# EAGLE design ElectronBoardMKII (EAGLE 9.2.0)
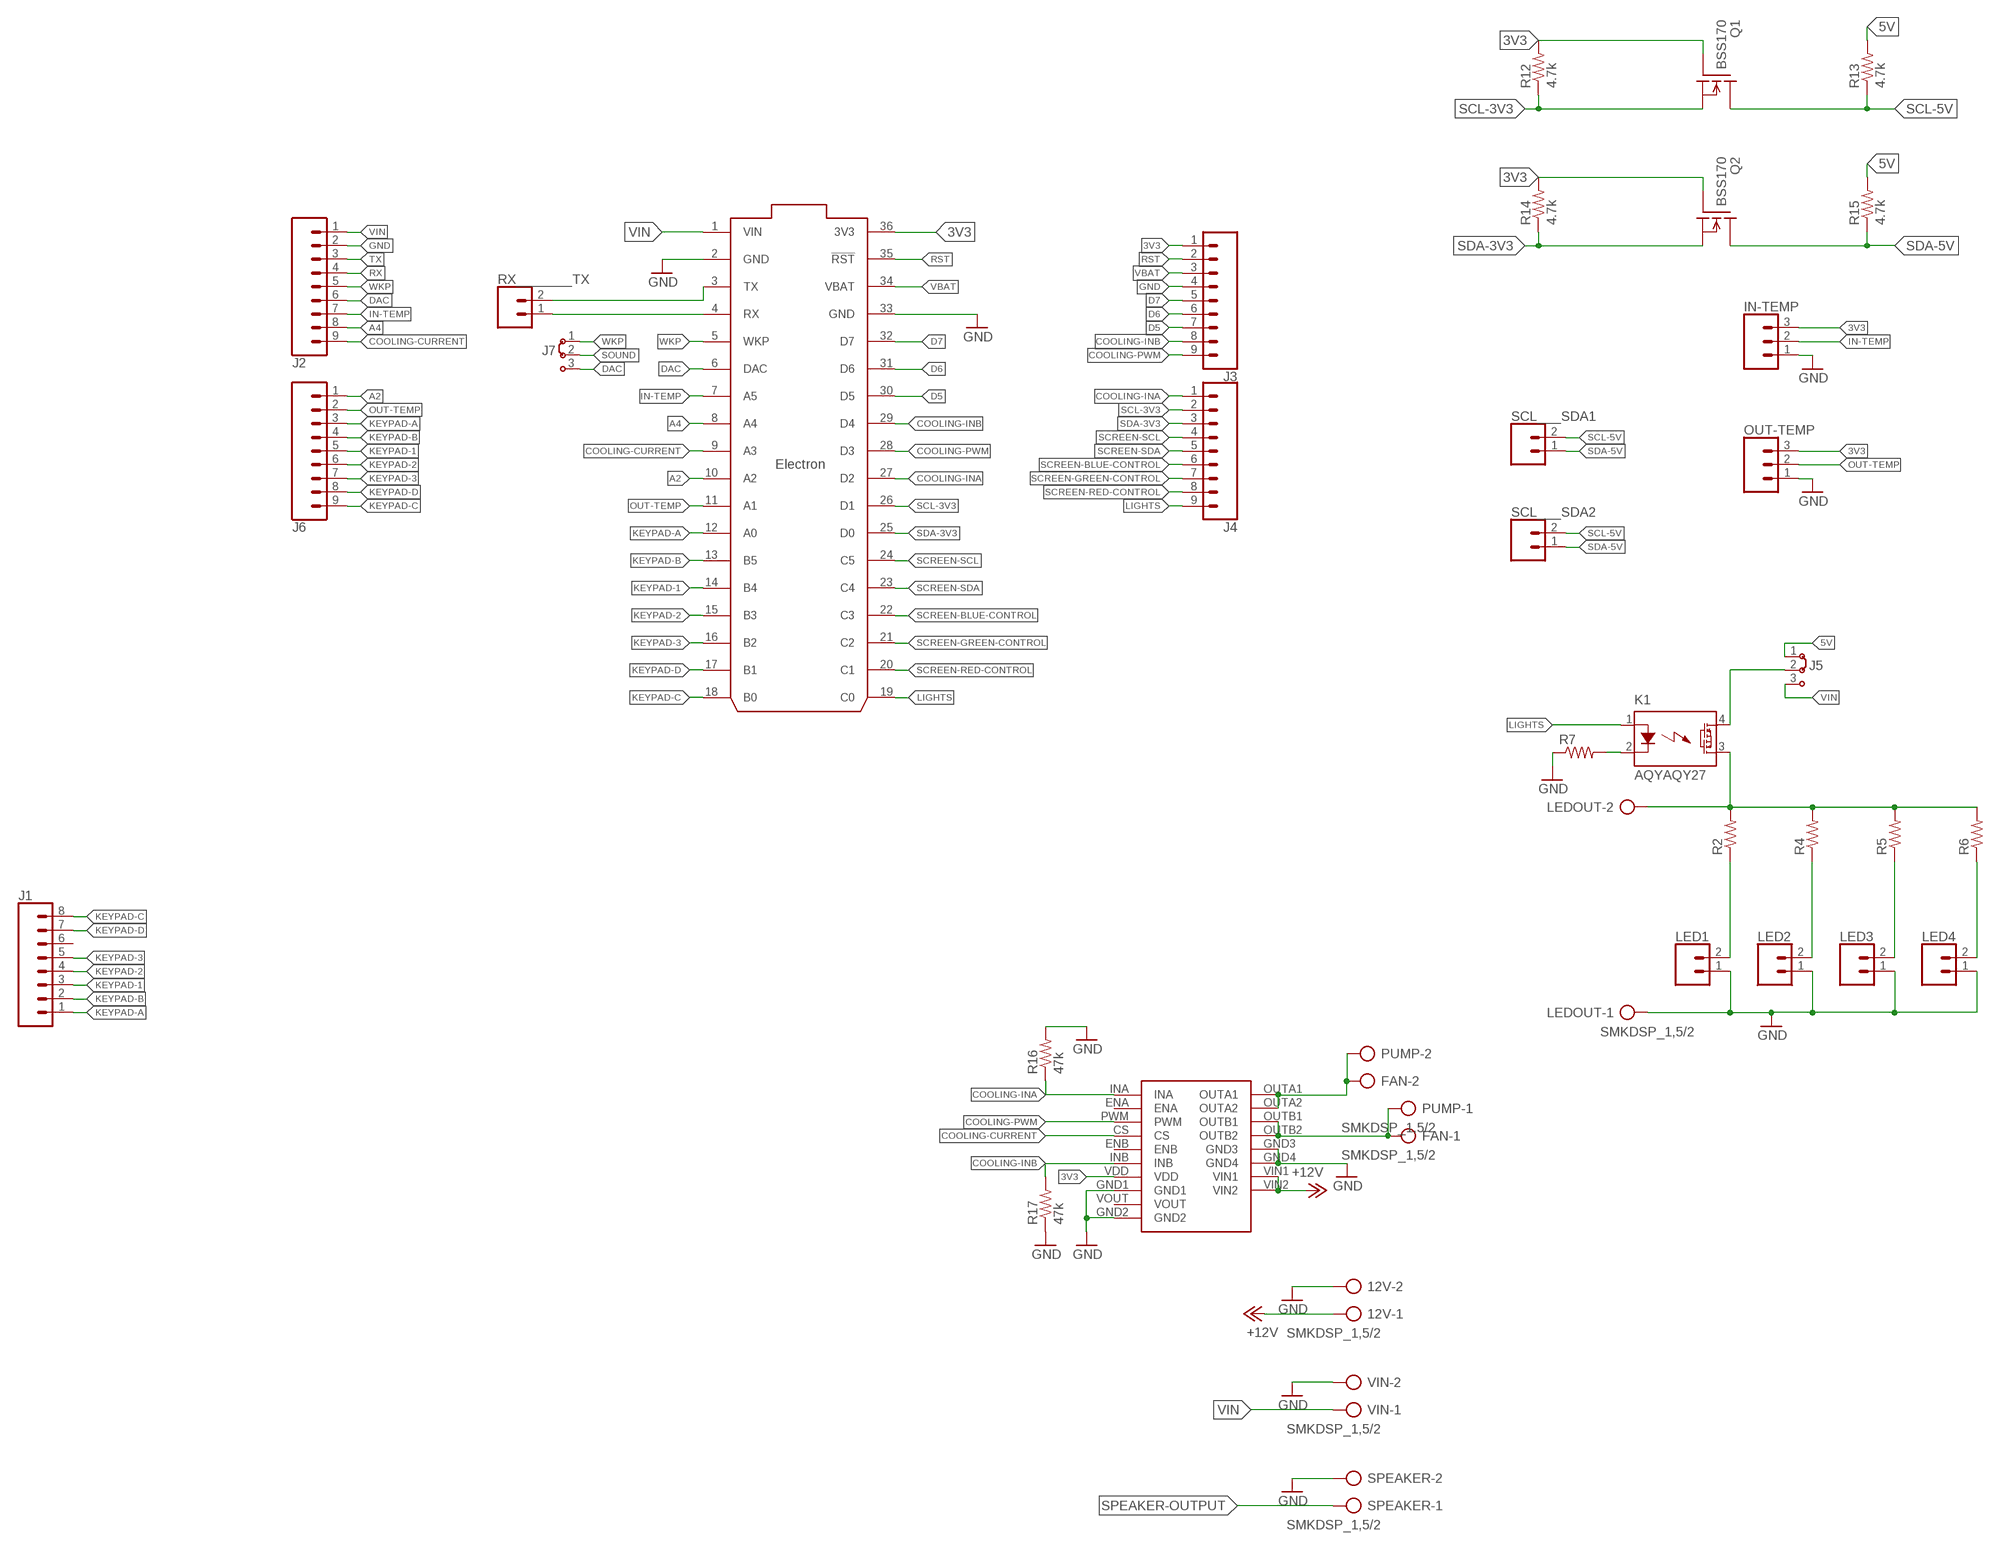
[diagram p0: schematic, sheet 1, part 1 of 2]
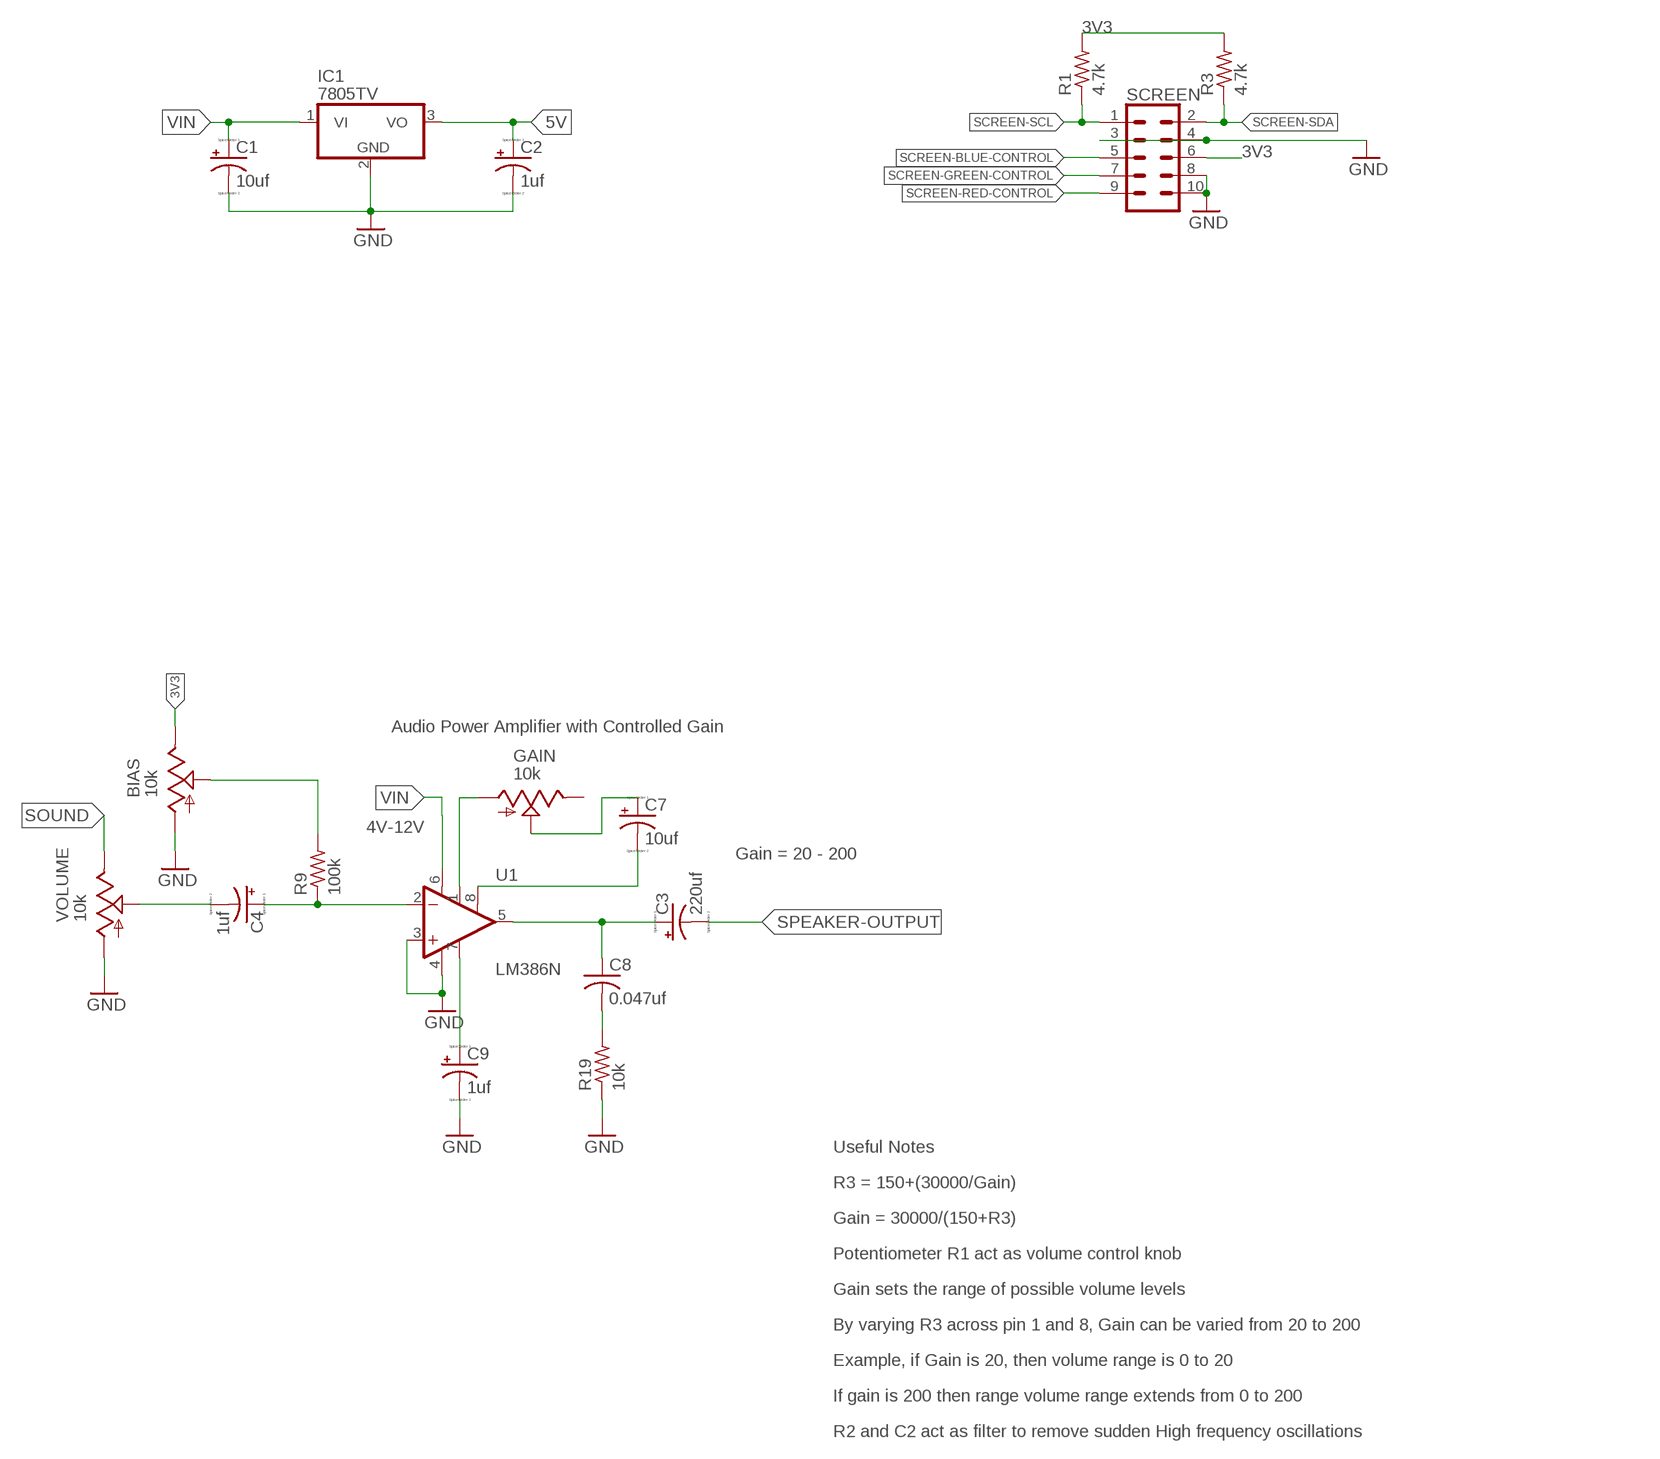
[diagram p1: schematic, sheet 1, part 2 of 2]

## Parts
12V  SMKDSP_1,5/2  [SMKDSP_1,5/2]
BIAS  10k  TRIM_US-CT6  [CT6]
C1  10uf  CPOL-USE5-8.5  [E5-8,5]
C2  1uf  CPOL-USE5-8.5  [E5-8,5]
C3  220uf  CPOL-USE5-8.5  [E5-8,5]
C4  1uf  CPOL-USE5-8.5  [E5-8,5]
C7  10uf  CPOL-USE5-8.5  [E5-8,5]
C8  0.047uf  C-US050-035X075  [C050-035X075]
C9  1uf  CPOL-USE5-8.5  [E5-8,5]
FAN  SMKDSP_1,5/2  [SMKDSP_1,5/2]
GAIN  10k  TRIM_US-CT6  [CT6]
IC1  7805TV  [TO220V]
IN-TEMP  CONN_03LOCK_LONGPADS  [1X03_LOCK_LONGPADS]
J1  CONN_08LOCK_LONGPADS  [1X08_LOCK_LONGPADS]
J2  CONN_09LOCK  [1X09_LOCK]
J3  CONN_09LOCK  [1X09_LOCK]
J4  CONN_09LOCK  [1X09_LOCK]
J5  J2X2MM  [04C]
J6  CONN_09LOCK  [1X09_LOCK]
J7  J2X2MM  [04C]
K1  AQYAQY27  [AQY27]
LED1  CONN_02LOCK_LONGPADS  [1X02_LOCK_LONGPADS]
LED2  CONN_02LOCK_LONGPADS  [1X02_LOCK_LONGPADS]
LED3  CONN_02LOCK_LONGPADS  [1X02_LOCK_LONGPADS]
LED4  CONN_02LOCK_LONGPADS  [1X02_LOCK_LONGPADS]
LEDOUT  SMKDSP_1,5/2  [SMKDSP_1,5/2]
OUT-TEMP  CONN_03LOCK_LONGPADS  [1X03_LOCK_LONGPADS]
PUMP  SMKDSP_1,5/2  [SMKDSP_1,5/2]
Q1  BSS170  BSS101  [TO92]
Q2  BSS170  BSS101  [TO92]
R1  4.7k  R-US_0207/12  [0207/12]
R2  R-US_0207/10  [0207/10]
R3  4.7k  R-US_0207/12  [0207/12]
R4  R-US_0207/10  [0207/10]
R5  R-US_0207/10  [0207/10]
R6  R-US_0207/10  [0207/10]
R7  R-US_0207/10  [0207/10]
R9  100k  R-US_0207/5V  [0207/5V]
R12  4.7k  R-US_0207/12  [0207/12]
R13  4.7k  R-US_0207/12  [0207/12]
R14  4.7k  R-US_0207/12  [0207/12]
R15  4.7k  R-US_0207/12  [0207/12]
R16  47k  R-US_0207/12  [0207/12]
R17  47k  R-US_0207/12  [0207/12]
R19  10k  R-US_0207/12  [0207/12]
RX_______TX  CONN_02LOCK_LONGPADS  [1X02_LOCK_LONGPADS]
SCL___SDA1  CONN_02LOCK_LONGPADS  [1X02_LOCK_LONGPADS]
SCL___SDA2  CONN_02LOCK_LONGPADS  [1X02_LOCK_LONGPADS]
SCREEN  CONN_05X2SHD  [2X5-SHROUDED]
SPEAKER  SMKDSP_1,5/2  [SMKDSP_1,5/2]
U1  LM386N  LM386  [DIP08]
U$1  ELECTRON_WITH_HEADERS  [ELECTRON]
U$2  VNH5019VNH5019BOARD  [DIP3302W60P254L2400H500Q20B]
VIN  SMKDSP_1,5/2  [SMKDSP_1,5/2]
VOLUME  10k  TRIM_US-CT6  [CT6]

## Nets
3V3: BIAS.E IN-TEMP.3 J3.1 OUT-TEMP.3 Q1.2(G) Q2.2(G) R1.2 R3.2 R12.2 R14.2 SCREEN.6 U$1.36(3V3) U$2.VDD
5V: C2.+ IC1.3(VO) J5.1 R13.2 R15.2
+12V: 12V.1 U$2.VIN1 U$2.VIN2
A2: J6.1 U$1.10(A2)
A4: J2.8 U$1.8(A4)
COOLING-CURRENT: J2.9 U$1.9(A3) U$2.CS
COOLING-INA: J4.1 R16.1 U$1.27(D2) U$2.INA
COOLING-INB: J3.8 R17.2 U$1.29(D4) U$2.INB
COOLING-OUTA: FAN.2 PUMP.2 U$2.OUTA1 U$2.OUTA2
COOLING-OUTB: FAN.1 PUMP.1 U$2.OUTB1 U$2.OUTB2
COOLING-PWM: J3.9 U$1.28(D3) U$2.PWM
D5: J3.7 U$1.30(D5)
D6: J3.6 U$1.31(D6)
D7: J3.5 U$1.32(D7)
DAC: J2.6 J7.3 U$1.6(DAC)
GND: 12V.2 BIAS.A C1.- C2.- C9.- IC1.2(GND) IN-TEMP.1 J2.2 J3.4 LED1.1 LED2.1 LED3.1 LED4.1 LEDOUT.1 OUT-TEMP.1 R7.1 R16.2 R17.1 R19.1 SCREEN.3 SCREEN.4 SCREEN.8 SCREEN.10 SPEAKER.2 U1.3(+IN) U1.4(V-) U$1.2(GND) U$1.33(GND) U$2.GND1 U$2.GND2 U$2.GND3 U$2.GND4 VIN.2 VOLUME.A
IN-TEMP: IN-TEMP.2 J2.7 U$1.7(A5)
KEYPAD-1: J1.3 J6.5 U$1.14(B4)
KEYPAD-2: J1.4 J6.6 U$1.15(B3)
KEYPAD-3: J1.5 J6.7 U$1.16(B2)
KEYPAD-A: J1.1 J6.3 U$1.12(A0)
KEYPAD-B: J1.2 J6.4 U$1.13(B5)
KEYPAD-C: J1.8 J6.9 U$1.18(B0)
KEYPAD-D: J1.7 J6.8 U$1.17(B1)
LIGHTS: J4.9 K1.1(A) U$1.19(C0)
N$1: C4.+ R9.1 U1.2(-IN)
N$2: C9.+ U1.7(BP)
N$3: LED4.2 R6.1
N$4: GAIN.A U1.1(GAIN)
N$5: C7.- U1.8(GAIN)
N$6: C3.+ C8.1 U1.5(OUT)
N$7: C8.2 R19.2
N$8: K1.2(K) R7.2
N$9: C7.+ GAIN.S
N$10: J5.2 K1.4(DS1)
N$11: K1.3(DS2) LEDOUT.2 R2.2 R4.2 R5.2 R6.2
N$12: LED1.2 R2.1
N$13: LED2.2 R4.1
N$14: C4.- VOLUME.S
N$15: LED3.2 R5.1
N$16: BIAS.S R9.2
OUT-TEMP: J6.2 OUT-TEMP.2 U$1.11(A1)
RST: J3.2 U$1.35(!RST)
RX: J2.4 RX_______TX.1 U$1.4(RX)
SCL-3V3: J4.2 Q1.1(S) R12.1 U$1.26(D1)
SCL-5V: Q1.3(D) R13.1 SCL___SDA1.2 SCL___SDA2.2
SCREEN-BLUE-CONTROL: J4.6 SCREEN.5 U$1.22(C3)
SCREEN-GREEN-CONTROL: J4.7 SCREEN.7 U$1.21(C2)
SCREEN-RED-CONTROL: J4.8 SCREEN.9 U$1.20(C1)
SCREEN-SCL: J4.4 R1.1 SCREEN.1 U$1.24(C5)
SCREEN-SDA: J4.5 R3.1 SCREEN.2 U$1.23(C4)
SDA-3V3: J4.3 Q2.1(S) R14.1 U$1.25(D0)
SDA-5V: Q2.3(D) R15.1 SCL___SDA1.1 SCL___SDA2.1
SOUND: J7.2 VOLUME.E
SPEAKER-OUTPUT: C3.- SPEAKER.1
TX: J2.3 RX_______TX.2 U$1.3(TX)
VBAT: J3.3 U$1.34(VBAT)
VIN: C1.+ IC1.1(VI) J2.1 J5.3 U1.6(V+) U$1.1(VIN) VIN.1
WKP: J2.5 J7.1 U$1.5(WKP)
Unconnected: GAIN.E J1.6 U$2.ENA U$2.ENB U$2.VOUT

## Notes on the sheet
- Audio Power Amplifier with Controlled Gain
- 4V-12V
- Gain = 20 - 200
- Useful Notes
- R3 = 150+(30000/Gain)
- Gain = 30000/(150+R3)
- Potentiometer R1 act as volume control knob
- Gain sets the range of possible volume levels
- By varying R3 across pin 1 and 8, Gain can be varied from 20 to 200
- Example, if Gain is 20, then volume range is 0 to 20
- If gain is 200 then range volume range extends from 0 to 200
- R2 and C2 act as filter to remove sudden High frequency oscillations

## Library data of the parts
12V FAN LEDOUT PUMP SPEAKER VIN = con-phoenix-smkdsp:SMKDSP_1,5/2: Printklemme, Nennstrom: 17,5 A, Bemessungsspannung: 250 V, Raster: 5,0 mm Source: http://eshop.phoenixcontact.de .. 1733415.pdf; MF: FARNELL; MPN: 1733570; OC_FARNELL: 3041244; OC_NEWARK: 69C8588
BIAS GAIN VOLUME = pot:TRIM_US-: POTENTIOMETER
C1-C4 C7 C9 = resistor:CPOL-US: POLARIZED CAPACITOR, American symbol
C8 = resistor:C-US: CAPACITOR, American symbol
IC1 = linear:78*: Positive VOLTAGE REGULATOR Source: http://cache.national.com/ds/LM/LM78L05.pdf http://www.fairchildsemi.com/ds/LM/LM7805.pdf
IN-TEMP OUT-TEMP = SparkFun-Connectors:CONN_03: Multi connection point. Often used as Generic Header-pin footprint for 0.1 inch spaced/style header connections On any of the 0.1 inch spaced packages, you can populate with these: Break Away Headers - Straight <https://www.sparkfun.com/products/116> (PRT-00116) Break Away Male Headers - Right Angle <https://www.sparkfun.com/products/553> (PRT-00553) Female Headers <https://www.sparkfun.com/products/115> (PRT-00115) Break Away Headers - Machine Pin <https://www.sparkfun.com/products/117> (PRT-00117) Break Away Female Headers - Swiss Machine Pin <https://www.sparkfun.com/products/743> (PRT-00743) Stackable Header - 3 Pin (Female, 0.1") <https://www.sparkfun.com/products/13875> (PRT-13875) For SCREWTERMINALS and SPRING TERMINALS visit here: Screw Terimnals on SparkFun.com <https://www.sparkfun.com/search/results?term=Screw+Terminals> (5mm/3.5mm/2.54mm spacing) This device is also useful as a general connection point to wire up your design to another part of your project. Our various solder wires solder well into these plated through hole pads. Hook-Up Wire - Assortment (Stranded, 22 AWG) <https://www.sparkfun.com/products/11375> (PRT-11375) Hook-Up Wire - Assortment (Solid Core, 22 AWG) <https://www.sparkfun.com/products/11367> (PRT-11367) View the entire wire category on our website here <https://www.sparkfun.com/categories/141> Special notes: Molex polarized connector foot print use with SKU : PRT-08232 with associated crimp pins and housings.
J1 = SparkFun-Connectors:CONN_08: Multi connection point. Often used as Generic Header-pin footprint for 0.1 inch spaced/style header connections On any of the 0.1 inch spaced packages, you can populate with these: Break Away Headers - Straight <https://www.sparkfun.com/products/116> (PRT-00116) Break Away Male Headers - Right Angle <https://www.sparkfun.com/products/553> (PRT-00553) Female Headers <https://www.sparkfun.com/products/115> (PRT-00115) Break Away Headers - Machine Pin <https://www.sparkfun.com/products/117> (PRT-00117) Break Away Female Headers - Swiss Machine Pin <https://www.sparkfun.com/products/743> (PRT-00743) Arduino Stackable Header - 8 Pin <https://www.sparkfun.com/products/9279> (PRT-09279) For SCREWTERMINALS and SPRING TERMINALS visit here: Screw Terimnals on SparkFun.com <https://www.sparkfun.com/search/results?term=Screw+Terminals> (5mm/3.5mm/2.54mm spacing) This device is also useful as a general connection point to wire up your design to another part of your project. Our various solder wires solder well into these plated through hole pads. Hook-Up Wire - Assortment (Stranded, 22 AWG) <https://www.sparkfun.com/products/11375> (PRT-11375) Hook-Up Wire - Assortment (Solid Core, 22 AWG) <https://www.sparkfun.com/products/11367> (PRT-11367) View the entire wire category on our website here <https://www.sparkfun.com/categories/141> Special notes: Molex polarized connector foot print use with SKU : PRT-08231 with associated crimp pins and housings. 1MM SMD Version SKU: PRT-10208 NOTES ON THE VARIANTS LOCK and LOCK_LONGPADS... This footprint was designed to help hold the alignment of a through-hole component (i.e. 6-pin header) while soldering it into place. You may notice that each hole has been shifted either up or down by 0.005 of an inch from it's more standard position (which is a perfectly straight line). This slight alteration caused the pins (the squares in the middle) to touch the edges of the holes. Because they are alternating, it causes a "brace" to hold the component in place. 0.005 has proven to be the perfect amount of "off-center" position when using our standard breakaway headers. Although looks a little odd when you look at the bare footprint, once you have a header in there, the alteration is very hard to notice. Also,if you push a header all the way into place, it is covered up entirely on the bottom side.
J2-J4 J6 = SparkFun-Connectors:CONN_09: Multi connection point. Often used as Generic Header-pin footprint for 0.1 inch spaced/style header connections On any of the 0.1 inch spaced packages, you can populate with these: Break Away Headers - Straight <https://www.sparkfun.com/products/116> (PRT-00116) Break Away Male Headers - Right Angle <https://www.sparkfun.com/products/553> (PRT-00553) Female Headers <https://www.sparkfun.com/products/115> (PRT-00115) Break Away Headers - Machine Pin <https://www.sparkfun.com/products/117> (PRT-00117) Break Away Female Headers - Swiss Machine Pin <https://www.sparkfun.com/products/743> (PRT-00743) For SCREWTERMINALS and SPRING TERMINALS visit here: Screw Terimnals on SparkFun.com <https://www.sparkfun.com/search/results?term=Screw+Terminals> (5mm/3.5mm/2.54mm spacing) This device is also useful as a general connection point to wire up your design to another part of your project. Our various solder wires solder well into these plated through hole pads. Hook-Up Wire - Assortment (Stranded, 22 AWG) <https://www.sparkfun.com/products/11375> (PRT-11375) Hook-Up Wire - Assortment (Solid Core, 22 AWG) <https://www.sparkfun.com/products/11367> (PRT-11367) View the entire wire category on our website here <https://www.sparkfun.com/categories/141> Special notes: Molex polarized connector foot print use with SKU : PRT-08231 with associated crimp pins and housings. 1MM SMD Version SKU: PRT-10208 NOTES ON THE VARIANTS LOCK and LOCK_LONGPADS... This footprint was designed to help hold the alignment of a through-hole component (i.e. 6-pin header) while soldering it into place. You may notice that each hole has been shifted either up or down by 0.005 of an inch from it's more standard position (which is a perfectly straight line). This slight alteration caused the pins (the squares in the middle) to touch the edges of the holes. Because they are alternating, it causes a "brace" to hold the component in place. 0.005 has proven to be the perfect amount of "off-center" position when using our standard breakaway headers. Although looks a little odd when you look at the bare footprint, once you have a header in there, the alteration is very hard to notice. Also,if you push a header all the way into place, it is covered up entirely on the bottom side.
J5 J7 = jumper:J2: Jumper switch 2 x 2.5 mm
K1 = relay:AQY*: PhotoMOS Relay NAiS Source: http://www.panasonic-electric-works.com/catalogues/downloads/photomos/ds_x615_en_aqz10_20.pdf; OC_FARNELL: unknown; OC_NEWARK: unknown
LED1-LED4 RX_______TX SCL___SDA1 SCL___SDA2 = SparkFun-Connectors:CONN_02: Multi connection point. Often used as Generic Header-pin footprint for 0.1 inch spaced/style header connections On any of the 0.1 inch spaced packages, you can populate with these: Break Away Headers - Straight <https://www.sparkfun.com/products/116> (PRT-00116) Break Away Male Headers - Right Angle <https://www.sparkfun.com/products/553> (PRT-00553) Female Headers <https://www.sparkfun.com/products/115> (PRT-00115) Break Away Headers - Machine Pin <https://www.sparkfun.com/products/117> (PRT-00117) Break Away Female Headers - Swiss Machine Pin <https://www.sparkfun.com/products/743> (PRT-00743) For SCREWTERMINALS and SPRING TERMINALS visit here: Screw Terimnals on SparkFun.com <https://www.sparkfun.com/search/results?term=Screw+Terminals> (5mm/3.5mm/2.54mm spacing) This device is also useful as a general connection point to wire up your design to another part of your project. Our various solder wires solder well into these plated through hole pads. Hook-Up Wire - Assortment (Stranded, 22 AWG) <https://www.sparkfun.com/products/11375> (PRT-11375) Hook-Up Wire - Assortment (Solid Core, 22 AWG) <https://www.sparkfun.com/products/11367> (PRT-11367) View the entire wire category on our website here <https://www.sparkfun.com/categories/141> Special notes: Molex polarized connector foot print use with: PRT-08233 with associated crimp pins and housings. 2.54_SCREWTERM for use with PRT-10571. 3.5mm Screw Terminal footprints for PRT-08084 5mm Screw Terminal footprints for use with PRT-08432
Q1 Q2 = transistor-fet:BSS101: N-Channel Enhancement MOSFET 200V; 0,16A; 11Ohm
R1 R3 R9 R12-R17 R19 = resistor:R-US_: RESISTOR, American symbol
R2 R4-R7 = adafruit:R-US_: RESISTOR, American symbol
SCREEN = SparkFun-Connectors:CONN_05X2: Multi connection point. Often used as Generic Header-pin footprint for 0.1 inch spaced/style header connections For AVR SPI programming port, see special device with nice symbol: "AVR_SPI_PROG_5x2.dev" You can populate with any combo of single row headers, but if you'd like an exact match, check these: 2x5 AVR ICSP Male Header <https://www.sparkfun.com/products/778> (PRT-00778) 2x5 Pin Shrouded Header <https://www.sparkfun.com/products/8506> (PRT-08506) On any of the 0.1 inch spaced packages, you can populate with these: Break Away Headers - Straight <https://www.sparkfun.com/products/116> (PRT-00116) Break Away Male Headers - Right Angle <https://www.sparkfun.com/products/553> (PRT-00553) Female Headers <https://www.sparkfun.com/products/115> (PRT-00115) Break Away Headers - Machine Pin <https://www.sparkfun.com/products/117> (PRT-00117) Break Away Female Headers - Swiss Machine Pin <https://www.sparkfun.com/products/743> (PRT-00743) Special note: the shrouded connector mates well with our 5x2 ribbon cables: 2x5 Pin IDC Ribbon Cable <https://www.sparkfun.com/products/8535> (PRT-08535); PROD_ID: CONN-08671; SF_ID: PRT-08506
U1 = SparkFun-IC-Amplifiers:LM386: low voltage audio power amplifier SparkFun Products FabFM Radio Kit <https://www.sparkfun.com/products/11043> (KIT-11043); PROD_ID: IC-10899
U$1 = Particle-Devices:ELECTRON: The Particle Electron is a tiny development kit for creating cellular-connected electronics projects and products. It comes with a SIM card (Nano 4FF) and an affordable data plan for low-bandwidth things. Design files : here <https://github.com/particle-iot/electron> Product Page : Datasheet <https://docs.particle.io/datasheets/electron-(cellular)/electron-datasheet/> Github : Particle devices library <https://github.com/particle-iot/hardware-libraries/tree/master/Eagle>
U$2 = VNH:VNH5019

## Board
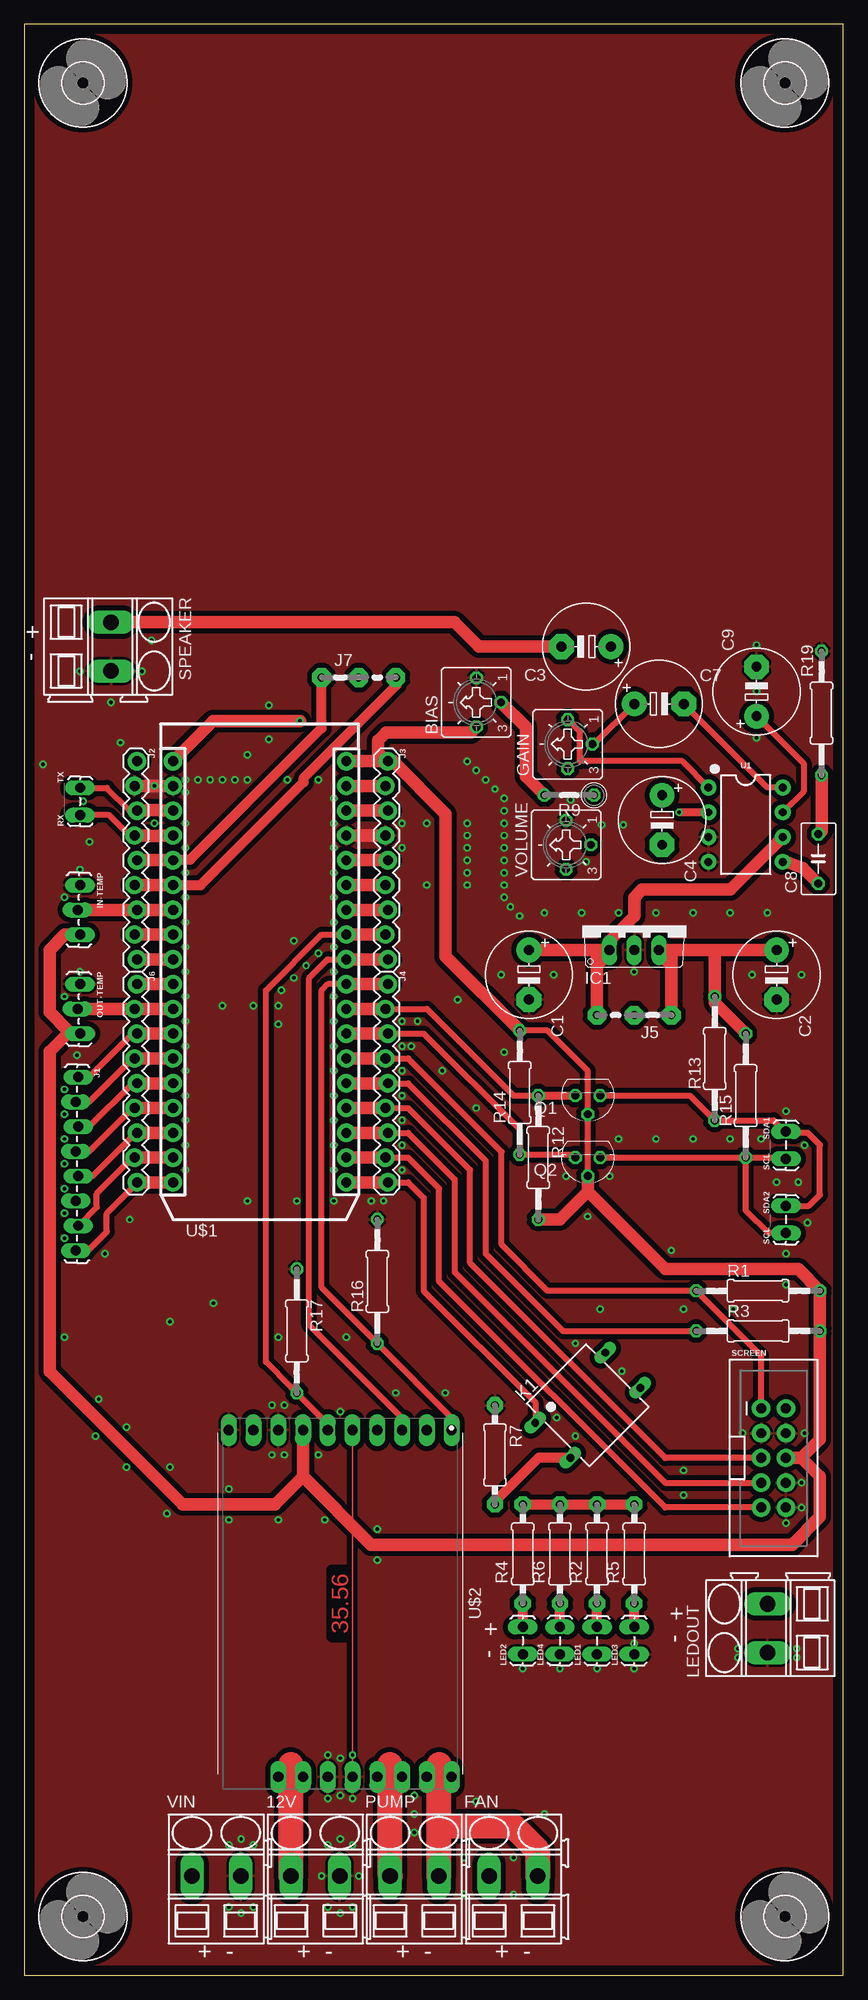
[diagram p2: board, top side]
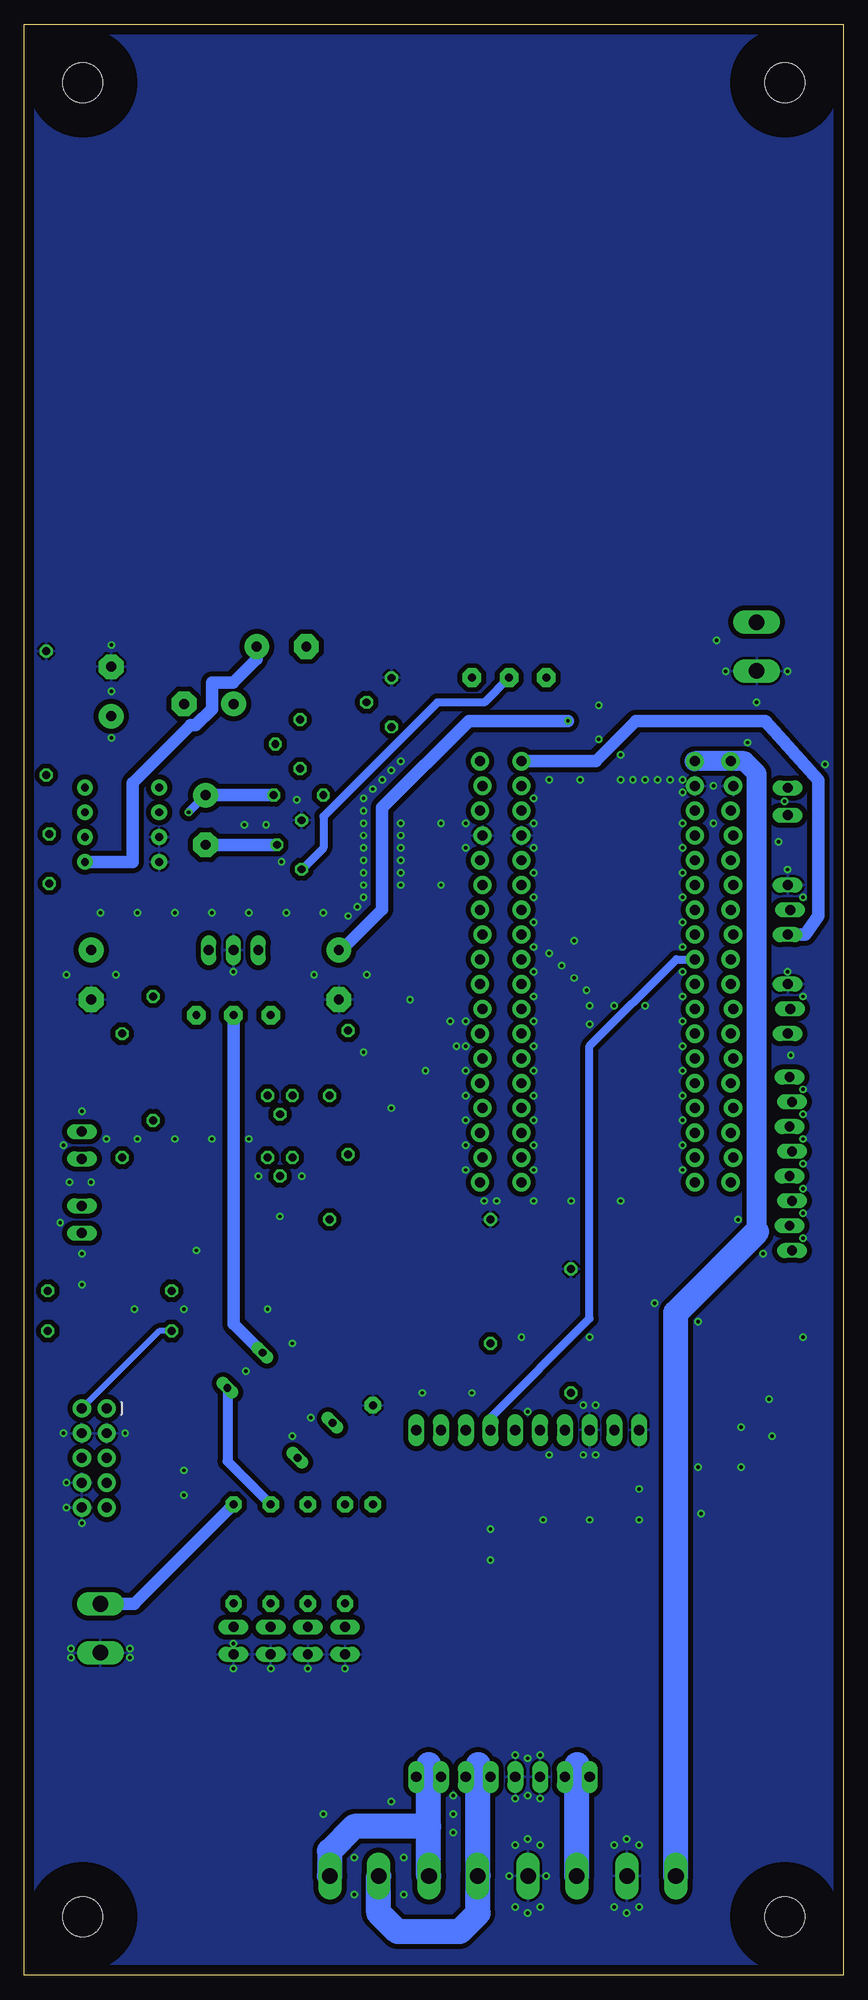
[diagram p3: board, bottom side, seen from below]

Size 84 x 200 mm. Coordinates in mm from the lower left corner, seen from the top.
Outline: 0,0 84,0 84,200 0,200 0,0
Copper layers (1*16): Top 0.035mm / dielectric 1.5mm / Bottom 0.035mm
Design rules "default *": minimum track width 6mil, minimum drill 0.35mm, track to track 20mil, track to pad 10mil, pad to pad 6mil, via to via 6mil, smd to smd 6mil, copper to edge 40mil, drill to drill 6mil, minimum pad ring 10mil, minimum via ring 8mil, stop-mask expansion 4mil, vias tented up to drill 0mil, thermal gap 10mil

### Footprints (pad centres in the part's own frame; a part is rotated, then mirrored left to right if it is on the bottom)
SMKDSP_1,5/2 = drill 1.6 pad 1.8 long: 1 -2.5,0; 2 2.5,0
CT6 = drill 0.813 octagon: A 2.515,0; E -2.515,0; S 0,-2.54
E5-8,5 = drill 1.016 pad 2.54: + -2.54,0 | drill 1.016 pad 2.54 octagon: - 2.54,0
C050-035X075 = drill 0.813 octagon: 1 -2.54,0; 2 2.54,0
TO220V = drill 1.016 long: 1 -2.54,-2.54; 2 0,-2.54; 3 2.54,-2.54
1X03_LOCK_LONGPADS = drill 1.016 long: 1 0,0; 2 2.54,-0.254; 3 5.08,0
1X08_LOCK_LONGPADS = drill 1.016 long: 1 0,0.127; 2 2.54,-0.127; 3 5.08,0.127; 4 7.62,-0.127; 5 10.16,0.127; 6 12.7,-0.127; 7 15.24,0.127; 8 17.78,-0.127
1X09_LOCK = drill 1.016 pad 1.88: 1 0,0.127; 2 2.54,-0.127; 3 5.08,0.127; 4 7.62,-0.127; 5 10.16,0.127; 6 12.7,-0.127; 7 15.24,0.127; 8 17.78,-0.127; 9 20.32,0.127
04C = drill 0.813 pad 1.905 octagon: 1 -1.905,0; 2 1.905,0; 3 5.715,0
AQY27 = drill 0.8 long: 1 -2.54,-5.08; 2 2.54,-5.08; 3 2.54,5.08; 4 -2.54,5.08
1X02_LOCK_LONGPADS = drill 1.016 long: 1 -0.127,0; 2 2.667,0
TO92 = drill 0.813 octagon: 1 1.27,0; 2 0,1.905; 3 -1.27,0
0207/12 = drill 0.813 octagon: 1 -6.35,0; 2 6.35,0
0207/10 = drill 0.813 pad 1.676 octagon: 1 -5.08,0; 2 5.08,0
0207/5V = drill 0.813 octagon: 1 -2.54,0; 2 2.54,0
2X5-SHROUDED = drill 1.016 pad 1.88: 1 -1.27,5.08; 2 1.27,5.08; 3 -1.27,2.54; 4 1.27,2.54; 5 -1.27,0; 6 1.27,0; 7 -1.27,-2.54; 8 1.27,-2.54; 9 -1.27,-5.08; 10 1.27,-5.08
DIP08 = drill 0.813 pad 1.626: 1 -3.81,-3.81; 2 -1.27,-3.81; 3 1.27,-3.81; 4 3.81,-3.81; 5 3.81,3.81; 6 1.27,3.81; 7 -1.27,3.81; 8 -3.81,3.81
ELECTRON = drill 1.016 pad 1.88: 1 1.27,46.99; 2 1.27,44.45; 3 1.27,41.91; 4 1.27,39.37; 5 1.27,36.83; 6 1.27,34.29; 7 1.27,31.75; 8 1.27,29.21; 9 1.27,26.67; 10 1.27,24.13; 11 1.27,21.59; 12 1.27,19.05; 13 1.27,16.51; 14 1.27,13.97; 15 1.27,11.43; 16 1.27,8.89; 17 1.27,6.35; 18 1.27,3.81; 19 19.05,3.81; 20 19.05,6.35; 21 19.05,8.89; 22 19.05,11.43; 23 19.05,13.97; 24 19.05,16.51; 25 19.05,19.05; 26 19.05,21.59; 27 19.05,24.13; 28 19.05,26.67; 29 19.05,29.21; 30 19.05,31.75; 31 19.05,34.29; 32 19.05,36.83; 33 19.05,39.37; 34 19.05,41.91; 35 19.05,44.45; 36 19.05,46.99
DIP3302W60P254L2400H500Q20B = drill 1.048 pad 1.649 long: CS -17.78,3.81; ENA -17.78,8.89; ENB -17.78,1.27; GND1 -17.78,-6.35; GND2 -17.78,-11.43; GND3 17.78,1.27; GND4 17.78,-1.27; INA -17.78,11.43; INB -17.78,-1.27; OUTA1 17.78,11.43; OUTA2 17.78,8.89; OUTB1 17.78,6.35; OUTB2 17.78,3.81; PWM -17.78,6.35; VDD -17.78,-3.81; VIN1 17.78,-3.81; VIN2 17.78,-6.35; VOUT -17.78,-8.89
4,1 = hole 4.1: 0,0

### Placement (x,y rotation side)
12V  29.84,10.16 0 top
BIAS  46.35,130.49 90 top
C1  51.75,102.55 270 top
C2  77.15,102.55 270 top
C3  57.63,136.21 180 top
C4  65.41,118.43 270 top
C7  65.09,130.33 0 top
C8  81.44,114.46 90 top
C9  75.09,131.6 90 top
FAN  50.16,10.16 0 top
GAIN  55.72,126.21 90 top
IC1  62.55,107.63 0 top
IN-TEMP  5.71,111.76 270 top
J1  5.4,92.08 270 top
J2  11.43,124.46 270 top
J3  37.15,124.46 270 top
J4  37.15,101.6 270 top
J5  64.45,98.42 180 top
J6  11.43,101.6 270 top
J7  32.38,133.03 0 top
K1  57.78,58.42 315 top
LED1  58.74,33.02 90 top
LED2  51.12,33.02 90 top
LED3  62.55,33.02 90 top
LED4  54.93,33.02 90 top
LEDOUT  76.2,35.56 90 top
OUT-TEMP  5.71,101.6 270 top
PUMP  40.01,10.16 0 top
Q1  57.78,90.17 180 top
Q2  57.78,83.82 180 top
R1  75.25,70.17 0 top
R2  58.74,43.18 90 top
R3  75.25,66.04 0 top
R4  51.12,43.18 90 top
R5  62.55,43.18 90 top
R6  54.93,43.18 90 top
R7  48.26,53.34 270 top
R9  55.88,120.97 180 top
R12  52.7,83.82 270 top
R13  70.8,93.98 90 top
R14  50.8,90.49 90 top
R15  73.98,90.17 90 top
R16  36.2,71.12 90 top
R17  27.94,66.04 270 top
R19  81.76,129.38 270 top
RX_______TX  5.71,119.06 90 top
SCL___SDA1  78.11,83.82 90 top
SCL___SDA2  78.11,76.2 90 top
SCREEN  76.83,53.02 0 top
SPEAKER  8.89,136.21 270 top
U1  73.98,117.95 270 top
U$1  13.97,77.47 0 top
U$2  32.38,38.1 270 top
U$3  [4,1]  6,194 0 top
U$4  [4,1]  78,194 0 top
U$5  [4,1]  6,6 0 top
U$6  [4,1]  78,6 0 top
VIN  19.68,10.16 0 top
VOLUME  55.56,115.89 90 top

### Tracks (layer width: path | path; a pad name or v marks a point on that pad's centre or on a via)
3V3
  Top 0.152: J3.1 37.78,124.46 | J3.1 36.83,124.46 | J3.1 37.68,124.46 37.73,124.51
  Top 0.635: R14.2 53.66,96.84 57.78,92.71 Q1.2 Q2.2
  Top 1.27: 4.61,96.68 2.6,94.68 2.6,61.91 16.26,48.26 25.72,48.26 28.57,51.12 | 28.57,51.12 U$2.VDD | 4.61,96.68 4.76,96.52 OUT-TEMP.3 6.67,96.52 | SCREEN.6 79.69,53.02 | 79.69,53.02 81.6,54.93 R3.2 R1.2 79.38,72.39 65.72,72.39 57.78,80.33 | R12.2 54.93,77.47 57.78,80.33 | 57.78,80.33 Q2.2 | 79.69,53.02 81.6,51.12 81.6,46.99 78.74,44.13 35.56,44.13 28.57,51.12 | R14.2 43.18,104.46 43.18,119.06 37.78,124.46 | 37.78,124.46 36.83,124.46 U$1.36 | IN-TEMP.3 4.13,106.68 2.6,105.08 2.6,98.75 4.61,96.68 | 37.78,124.46 37.73,124.51 37.09,124.51 36.25,125.36 36.25,126.56 37.09,127.41 45.78,127.41 BIAS.E
  Bottom 1.27: U$1.36 25.4,124.46 21.27,128.59 8.01,128.59 2.6,122.52 2.6,108.58 3.91,106.68 IN-TEMP.3
5V
  Top 1.27: 66.36,105.09 70.8,105.09 R13.2 70.8,99.69 R15.2 | 66.36,105.09 IC1.3 | IC1.3 66.36,105.09 | 66.36,105.09 C2.+ | J5.1 66.36,103.5 | 66.36,103.5 66.36,105.09 | IC1.3 65.09,104.78 66.36,103.5
+12V
  Top 1.27: U$2.VIN1 27.3,21.59 U$2.VIN2
  Top 2.54: 12V.1 27.34,21.55 27.3,21.59
  Bottom 2.54: 12V.1 27.34,21.55 27.3,21.59
A2
  Top 1.27: J6.1 U$1.10
A4
  Top 1.27: J2.8 U$1.8
COOLING-CURRENT
  Top 1.27: J2.9 U$1.9
  Bottom 0.813: U$2.CS 36.2,57.15 26.04,67.31 26.04,95.25 17.14,104.14 U$1.9
COOLING-INA
  Top 0.635: U$2.INA 43.81,57.15 R16.1 30.48,70.48 30.48,100.97 31.11,101.6 U$1.27
  Top 1.27: U$1.27 J4.1
COOLING-INB
  Top 0.152: R17.2 27.3,60.33
  Top 0.635: U$1.29 30.48,106.68 24.77,100.97 24.77,62.87 27.3,60.33 31.11,56.52 U$2.INB
  Top 1.27: J3.8 U$1.29
COOLING-OUTA
  Top 1.27: U$2.OUTA1 42.55,21.59 U$2.OUTA2
  Top 2.54: PUMP.2 42.51,15.24 | 42.51,15.24 42.51,21.55 42.55,21.59 | FAN.2 52.66,12.74 50.16,15.24 42.51,15.24
  Bottom 2.54: PUMP.2 42.55,10.2 42.55,15.24 | 42.55,15.24 42.55,21.59 | 42.55,15.24 50.16,15.24 52.7,12.7 52.7,10.2 FAN.2
COOLING-OUTB
  Top 1.27: U$2.OUTB1 37.47,21.59 U$2.OUTB2
  Top 2.54: PUMP.1 37.51,21.55 37.47,21.59
  Bottom 2.54: 37.47,21.59 37.47,10.2 PUMP.1 37.51,6.39 37.47,6.35 39.37,4.45 45.72,4.45 47.66,6.39 FAN.1
COOLING-PWM
  Top 0.635: U$2.PWM 38.73,57.15 29.21,66.67 29.21,102.23 31.11,104.14 U$1.28
  Top 1.27: U$1.28 J3.9
D5
  Top 1.27: U$1.30 J3.7
D6
  Top 1.27: U$1.31 J3.6
D7
  Top 1.27: U$1.32 J3.5
DAC
  Top 0.61: J7.3 38.21,132.92 38.21,132.83
  Top 1.016: U$1.6 18.1,111.76 28.64,122.3 28.64,122.74 38.21,132.31 38.21,132.83
  Top 1.27: J2.6 U$1.6
GND  (via drill 0.35)
  Top 1.27: U$1.33 J3.4 | J2.2 U$1.2
  other vias: 22.86,79.38 25.4,58.42 26.67,53.34 26.67,58.42 25.4,53.34 20.95,13.34 23.5,13.34 20.95,6.99 23.5,6.99 22.23,6.35 22.23,13.97 31.11,13.34 33.66,13.34 31.11,6.99 33.66,6.99 32.38,13.97 32.38,6.35 30.48,10.16 34.29,10.16 31.11,22.54 33.66,22.54 32.38,22.23 31.11,18.1 32.38,18.41 33.66,18.1 22.86,125.09 21.59,122.56 22.86,122.56 45.4,124.46 46.35,123.51 47.31,122.56 48.26,121.6 48.9,102.55 54.29,102.55 74.61,102.55 79.69,102.55 53.34,108.9 62.55,102.87 9.84,126.36 1.91,124.14 31.75,79.38 35.56,79.38 13.34,118.11 5.71,102.87 26.04,99.38 23.5,99.38 27.62,102.23 20.32,99.38 5.71,113.35 4.13,110.49 6.03,120.33 6.67,116.2 27.94,79.38 31.75,97.79 40.32,97.79 27.62,106.05 41.27,118.11 60.96,85.72 64.77,85.72 68.58,85.72 72.39,85.72 57.15,108.9 60.96,108.9 64.77,108.9 68.58,108.9 72.39,108.9 76.2,108.9 40.01,16.51 40.01,18.41 40.01,14.61 45.09,12.06 45.09,8.26 50.16,12.06 50.16,8.26 46.35,17.78 53.34,16.51 32.38,57.78 26.04,65.41 36.2,42.55 38.1,59.69 33.02,65.41 30.16,53.34 38.73,118.11 20.95,46.67 36.2,45.72 41.27,111.76 75.56,85.72 78.11,73.98 80.33,77.15 78.11,88.58 80.01,85.09 77.15,81.28 79.38,81.28 4.13,65.41 7.62,59.05 49.85,109.54 10.48,52.07 7.3,55.24 8.89,130.49 4.13,88.27 4.13,85.72 4.13,83.19 4.13,80.64 4.13,78.11 43.18,59.69 36.83,79.38 57.63,114.14 56.04,120.49 42.86,92.71 46.35,88.9 59.05,68.26 80.01,55.56 73.66,55.56 79.69,50.48 79.69,47.94 78.11,46.35 56.52,64.77 67.63,51.75 67.63,49.21 55.56,81.92 60.01,81.92 57.78,77.79 72.71,68.26 78.11,70.8 67.63,68.26 25.08,126.68 25.08,130.18 12.06,133.67 5.71,133.67 13.02,136.84 44.45,100.01 49.21,94.61 4.13,75.56 20.32,122.56 19.05,122.56 17.78,122.56 4.13,90.81 4.13,100.33 16.51,121.28 16.51,122.56 26.99,122.56 30.16,122.56 16.51,118.11 16.51,115.57 16.51,113.03 16.51,110.49 16.51,107.95 16.51,105.41 16.51,102.87 16.51,100.33 16.51,97.79 16.51,95.25 16.51,92.71 16.51,90.17 16.51,87.63 16.51,85.09 16.51,82.55 31.75,82.55 31.75,85.09 31.75,87.63 31.75,90.17 31.75,92.71 31.75,95.25 31.75,107.95 31.75,110.49 31.75,113.03 31.75,115.57 31.75,118.11 31.75,120.65 38.73,92.71 38.73,90.17 38.73,87.63 38.73,85.09 38.73,95.25 39.69,95.25 38.73,97.79 31.75,105.41 31.75,102.87 31.75,100.33 30.16,104.78 28.89,103.5 26.35,100.97 26.04,97.47 26.04,46.67 30.8,46.67 20.95,49.85 10.48,56.2 14.92,52.07 14.61,47.31 14.92,66.99 19.37,68.9 10.79,77.47 8.26,73.98 59.21,117.95 61.44,117.95 73.18,33.5 73.18,32.54 79.22,32.54 79.22,33.5 54.93,31.43 51.12,31.43 58.74,31.43 62.55,31.43 62.55,33.97 75.09,131.6 75.09,136.37 75.09,126.84 54.61,57.15 38.73,82.55 5.4,94.3 38.73,115.57 13.34,121.92 66.36,74.3 56.52,55.24 61.28,61.91 49.21,120.65 49.21,119.38 49.21,114.3 49.21,113.03 49.21,111.76 49.21,110.49 50.8,108.58 45.4,111.76 45.4,113.03 45.4,114.3 45.4,115.57 45.4,116.84 45.4,118.11 49.21,115.57 49.21,116.84 49.21,118.11
  pour Bottom (isolate 0.508): -19.05,226.06 -19.05,-26.67 110.49,-26.67 110.49,226.06
  pour Top: -7.62,210.82 -7.62,-13.97 97.79,-13.97 97.79,212.09 -6.35,212.09
IN-TEMP
  Top 1.27: U$1.7 J2.7 IN-TEMP.2
KEYPAD-1
  Top 0.61: J6.5 11.11,91.44
  Top 0.635: J1.3 6.67,87 11.11,91.44
  Top 1.27: J6.5 U$1.14
KEYPAD-2
  Top 0.152: J6.6 11.11,88.9
  Top 0.635: J1.4 6.67,84.45 11.11,88.9
  Top 1.27: J6.6 U$1.15
KEYPAD-3
  Top 0.152: J6.7 11.43,86.36
  Top 0.635: J1.5 6.99,81.92 11.43,86.36
  Top 1.27: J6.7 U$1.16
KEYPAD-A
  Top 0.61: J6.3 11.11,96.52
  Top 0.635: J1.1 6.67,92.08 11.11,96.52
  Top 1.27: J6.3 U$1.12
KEYPAD-B
  Top 0.61: J6.4 11.11,93.98
  Top 0.635: J1.2 6.67,89.53 11.11,93.98
  Top 1.27: J6.4 U$1.13
KEYPAD-C
  Top 0.152: J6.9 11.3,81.28 11.11,81.09
  Top 0.635: J1.8 6.54,74.3 8.45,76.2 8.45,78.11 11.11,80.77 11.11,81.09
  Top 1.27: J6.9 U$1.18
KEYPAD-D
  Top 0.152: J6.8 11.11,83.82
  Top 0.635: 11.11,83.82 7.43,80.14 7.43,78.74 J1.7
  Top 1.27: J6.8 U$1.17
LIGHTS
  Top 0.635: J4.9 39.37,81.28 40.96,79.69 40.96,70.17 52.4,58.73 K1.1
  Top 1.27: U$1.19 J4.9
N$1  (via drill 0.4)
  Top 0.813: v67.15,119.22 U1.2
  Bottom 0.813: C4.+ v67.15,119.22
  Bottom 1.27: R9.1 C4.+
N$2
  Top 0.635: C9.+ 79.91,124.24 79.91,121.35 U1.7
N$3
  Top 1.016: LED4.2 R6.1
N$4
  Top 0.635: U1.1 67.47,124.46 56.99,124.46 56.99,127.45 GAIN.A
N$5
  Top 0.635: U1.8 76.2,121.76 C7.-
N$6
  Top 1.27: U1.5 77.9,114.14 77.96,114.21 79.85,113.51 C8.1
  Bottom 1.27: U1.5 72.91,114.14 72.91,122.19 66.93,128.18 66.42,128.18 64.77,129.82 64.77,132.49 62.61,132.49 60.17,134.94 C3.+
N$7
  Top 1.27: C8.2 81.76,117.32 R19.2
N$8
  Top 1.016: K1.2 52.73,53.03 48.26,48.56 R7.2
N$9
  Top 0.635: C7.+ 58.42,126.21 GAIN.S
N$10
  Bottom 1.27: J5.2 62.55,66.78 K1.4
N$11
  Top 1.016: R4.2 R6.2 R2.2 R5.2
  Bottom 1.016: K1.3 63.17,52.7 R2.2
  Bottom 1.27: R5.2 72.75,38.06 LEDOUT.2
N$12
  Top 1.016: LED1.2 R2.1
N$13
  Top 1.016: LED2.2 R4.1
N$14
  Bottom 1.27: VOLUME.S C4.-
N$15
  Top 1.016: LED3.2 R5.1
N$16
  Top 1.27: BIAS.S 51.44,127.95 51.44,122.87 R9.2
OUT-TEMP
  Top 1.27: U$1.11 J6.2 OUT-TEMP.2
RST
  Top 1.27: U$1.35 J3.2
RX
  Top 0.152: J2.4 10.79,116.84
  Top 0.635: RX_______TX.1 8.7,118.94 10.79,116.84
  Top 1.27: J2.4 12.72,116.84 12.78,116.78 13.89,116.78 13.95,116.84 U$1.4
SCL-3V3
  Top 0.635: R12.1 50.16,90.17 41.27,99.06 J4.2
  Top 0.813: R12.1 Q1.1
  Top 1.27: U$1.26 J4.2
SCL-5V
  Top 0.635: Q1.3 68.26,90.17 R13.1 76.83,87.63 78.11,86.36 | 78.11,86.36 SCL___SDA1.2 | SCL___SDA2.2 80.45,78.87 81.6,80.01 81.6,85.09 80.33,86.36 78.11,86.36
SCREEN-BLUE-CONTROL
  Top 0.635: SCREEN.5 65.72,53.02 45.72,73.03 45.72,82.55 39.37,88.9 36.83,88.9 J4.6
  Top 1.27: U$1.22 36.83,88.9
SCREEN-GREEN-CONTROL
  Top 0.635: SCREEN.7 65.72,50.48 44.13,72.07 44.13,81.6 39.37,86.36 37.15,86.36 J4.7
  Top 1.27: U$1.21 37.15,86.36
SCREEN-RED-CONTROL
  Top 0.635: SCREEN.9 65.72,47.94 42.55,71.12 42.55,80.64 39.37,83.82 36.83,83.82 J4.8
  Top 1.27: U$1.20 36.83,83.82
SCREEN-SCL
  Top 0.635: SCREEN.1 75.56,63.5 R1.1 53.66,70.17 48.93,74.89 48.93,84.42 39.37,93.98 36.51,93.98 J4.4
  Top 1.27: U$1.24 36.51,93.98
SCREEN-SDA
  Top 0.635: R3.1 55.24,66.04 47.31,73.98 47.31,83.5 39.37,91.44 J4.5
  Top 1.27: U$1.23 J4.5
  Bottom 0.635: R3.1 70.17,66.04 SCREEN.2
SDA-3V3
  Top 0.635: Q2.1 56.2,84.14 R14.1 50.8,86.68 40.96,96.52 J4.3
  Top 1.27: U$1.25 J4.3
SDA-5V
  Top 0.635: 78.11,83.82 SCL___SDA1.1 77.98,83.82 R15.1 | Q2.3 R15.1 | SCL___SDA2.1 76.33,76.07 73.98,78.42 R15.1
SOUND
  Top 0.61: 34.38,133.03 J7.2
  Bottom 0.61: 34.38,133.03 J7.2
  Bottom 0.813: VOLUME.E 55.54,113.37 53.34,115.57 53.34,118.8 41.65,130.49 36.83,130.49 J7.2
SPEAKER-OUTPUT
  Top 1.27: SPEAKER.1 44.13,138.71 46.63,136.21 C3.-
TX
  Top 0.61: J2.3 10.79,119.38
  Top 0.635: RX_______TX.2 8.45,121.73 10.79,119.38
  Top 1.27: J2.3 12.72,119.38 12.78,119.44 13.89,119.44 13.95,119.38 U$1.3
VBAT
  Top 1.27: J3.3 U$1.34
VIN  (via drill 0.35)
  Top 1.27: v28.26,128.59 19.37,128.59 U$1.1 | IC1.1 58.74,105.09 | 58.74,105.09 C1.+ | J5.3 58.74,103.5 | 58.74,103.5 58.74,105.09 | IC1.1 60.01,104.78 58.74,103.5 | IC1.1 60.01,106.05 62.55,108.58 62.55,110.49 63.34,111.28 72.39,111.28 U1.6
  Bottom 0.61: J2.1 10.16,124.46
  Bottom 1.27: v28.26,128.59 38.42,128.59 47.31,119.7 47.31,109.24 51.52,105.03 51.81,105.03 C1.+
  Bottom 2.032: U$1.1 10.16,124.46 8.89,123.19 8.89,76.2
  Bottom 2.54: VIN.1 17.18,67.91 8.89,76.2
WKP
  Top 1.016: U$1.5 15.31,114.37 17.01,114.37 22.61,119.97 30.48,127.84 J7.1
  Top 1.27: J2.5 U$1.5
(copper drawn outside any net)
  shapes: Top area x1

### Text on the board
tNames: + - | + - | + - | + - | + - | + - | + -